# Altium schematic sheet 3- balenaFin HAT MECH.SchDoc
size A
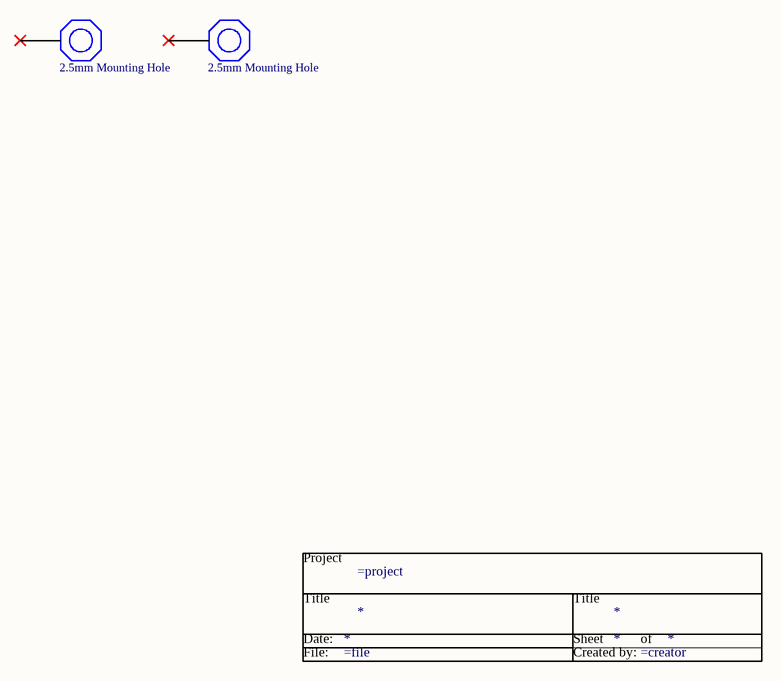
[diagram p0: 3- balenaFin HAT MECH.SchDoc]

## Parts
*  Title_Block  (value not drawn)  (graphical)
M1  2.5mm Mounting Hole  [2.5mm Mounting Hole]  (no BOM)
M2  2.5mm Mounting Hole  [2.5mm Mounting Hole]  (no BOM)

## Nets

Not connected (* = marked no-connect by the designer): M1 1*; M2 1*

## Notes on the sheet
- (in symbol Title_Block) Project; Title; Date:; Sheet; of; File:; Created by: